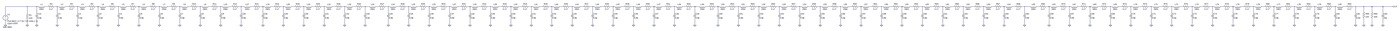
[diagram p0: schematic 64 cell_pc(V)=1000.asc, whole sheet]
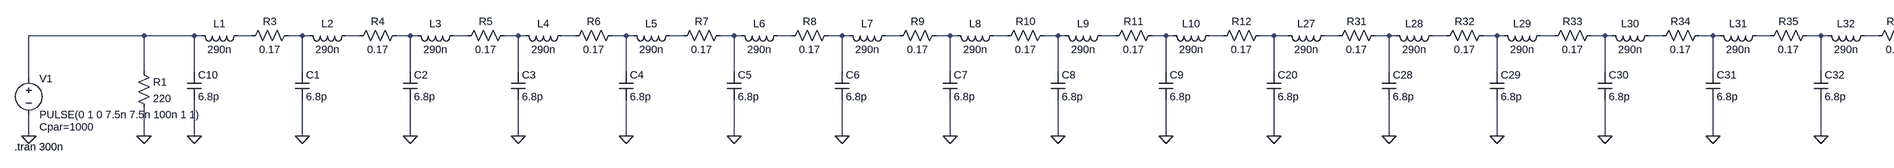
[diagram p1: schematic 64 cell_pc(V)=1000.asc, part, row 1 of 1, column 1 of 4]
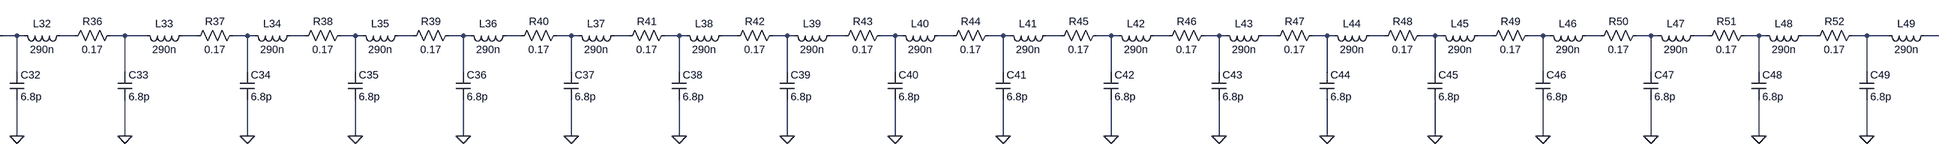
[diagram p2: schematic 64 cell_pc(V)=1000.asc, part, row 1 of 1, column 2 of 4]
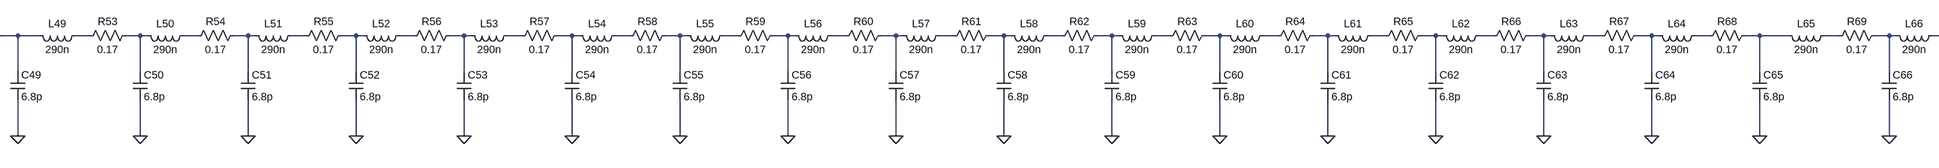
[diagram p3: schematic 64 cell_pc(V)=1000.asc, part, row 1 of 1, column 3 of 4]
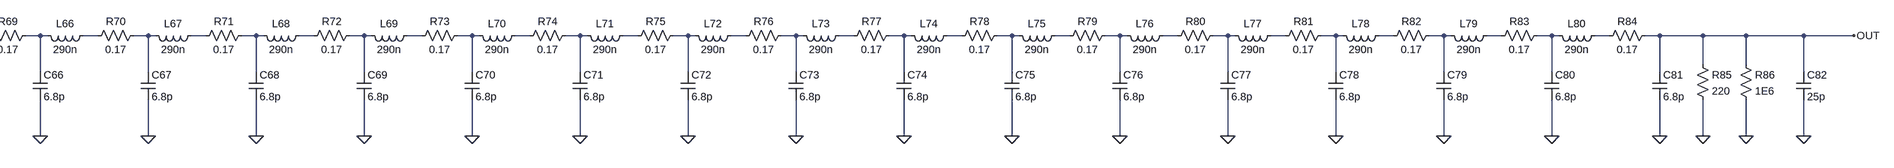
[diagram p4: schematic 64 cell_pc(V)=1000.asc, part, row 1 of 1, column 4 of 4]
64 cell_pc(V)=1000.asc, the LTspice schematic file:
Version 4
SHEET 1 14948 740
WIRE -1152 48 -1408 48
WIRE -1040 48 -1152 48
WIRE -1024 48 -1040 48
WIRE -912 48 -944 48
WIRE -800 48 -832 48
WIRE -784 48 -800 48
WIRE -672 48 -704 48
WIRE -560 48 -592 48
WIRE -544 48 -560 48
WIRE -432 48 -464 48
WIRE -320 48 -352 48
WIRE -304 48 -320 48
WIRE -192 48 -224 48
WIRE -80 48 -112 48
WIRE -64 48 -80 48
WIRE 48 48 16 48
WIRE 160 48 128 48
WIRE 176 48 160 48
WIRE 288 48 256 48
WIRE 400 48 368 48
WIRE 416 48 400 48
WIRE 528 48 496 48
WIRE 640 48 608 48
WIRE 656 48 640 48
WIRE 768 48 736 48
WIRE 880 48 848 48
WIRE 896 48 880 48
WIRE 1008 48 976 48
WIRE 1120 48 1088 48
WIRE 1136 48 1120 48
WIRE 1248 48 1216 48
WIRE 1360 48 1328 48
WIRE 1392 48 1360 48
WIRE 1504 48 1472 48
WIRE 1616 48 1584 48
WIRE 1632 48 1616 48
WIRE 1744 48 1712 48
WIRE 1856 48 1824 48
WIRE 1872 48 1856 48
WIRE 1984 48 1952 48
WIRE 2096 48 2064 48
WIRE 2112 48 2096 48
WIRE 2224 48 2192 48
WIRE 2336 48 2304 48
WIRE 2352 48 2336 48
WIRE 2464 48 2432 48
WIRE 2576 48 2544 48
WIRE 2592 48 2576 48
WIRE 2704 48 2672 48
WIRE 2816 48 2784 48
WIRE 2864 48 2816 48
WIRE 2976 48 2944 48
WIRE 3088 48 3056 48
WIRE 3104 48 3088 48
WIRE 3216 48 3184 48
WIRE 3328 48 3296 48
WIRE 3344 48 3328 48
WIRE 3456 48 3424 48
WIRE 3568 48 3536 48
WIRE 3584 48 3568 48
WIRE 3696 48 3664 48
WIRE 3808 48 3776 48
WIRE 3824 48 3808 48
WIRE 3936 48 3904 48
WIRE 4048 48 4016 48
WIRE 4064 48 4048 48
WIRE 4176 48 4144 48
WIRE 4288 48 4256 48
WIRE 4304 48 4288 48
WIRE 4416 48 4384 48
WIRE 4528 48 4496 48
WIRE 4544 48 4528 48
WIRE 4656 48 4624 48
WIRE 4768 48 4736 48
WIRE 4784 48 4768 48
WIRE 4896 48 4864 48
WIRE 5008 48 4976 48
WIRE 5024 48 5008 48
WIRE 5136 48 5104 48
WIRE 5248 48 5216 48
WIRE 5264 48 5248 48
WIRE 5376 48 5344 48
WIRE 5488 48 5456 48
WIRE 5504 48 5488 48
WIRE 5616 48 5584 48
WIRE 5728 48 5696 48
WIRE 5744 48 5728 48
WIRE 5856 48 5824 48
WIRE 5968 48 5936 48
WIRE 5984 48 5968 48
WIRE 6096 48 6064 48
WIRE 6208 48 6176 48
WIRE 6224 48 6208 48
WIRE 6336 48 6304 48
WIRE 6448 48 6416 48
WIRE 6464 48 6448 48
WIRE 6576 48 6544 48
WIRE 6688 48 6656 48
WIRE 6736 48 6688 48
WIRE 6848 48 6816 48
WIRE 6960 48 6928 48
WIRE 6976 48 6960 48
WIRE 7088 48 7056 48
WIRE 7200 48 7168 48
WIRE 7216 48 7200 48
WIRE 7328 48 7296 48
WIRE 7440 48 7408 48
WIRE 7456 48 7440 48
WIRE 7568 48 7536 48
WIRE 7680 48 7648 48
WIRE 7696 48 7680 48
WIRE 7808 48 7776 48
WIRE 7920 48 7888 48
WIRE 7936 48 7920 48
WIRE 8048 48 8016 48
WIRE 8160 48 8128 48
WIRE 8176 48 8160 48
WIRE 8288 48 8256 48
WIRE 8400 48 8368 48
WIRE 8416 48 8400 48
WIRE 8528 48 8496 48
WIRE 8640 48 8608 48
WIRE 8656 48 8640 48
WIRE 8768 48 8736 48
WIRE 8880 48 8848 48
WIRE 8896 48 8880 48
WIRE 9008 48 8976 48
WIRE 9120 48 9088 48
WIRE 9136 48 9120 48
WIRE 9248 48 9216 48
WIRE 9360 48 9328 48
WIRE 9376 48 9360 48
WIRE 9488 48 9456 48
WIRE 9600 48 9568 48
WIRE 9616 48 9600 48
WIRE 9728 48 9696 48
WIRE 9840 48 9808 48
WIRE 9856 48 9840 48
WIRE 9968 48 9936 48
WIRE 10080 48 10048 48
WIRE 10096 48 10080 48
WIRE 10208 48 10176 48
WIRE 10320 48 10288 48
WIRE 10336 48 10320 48
WIRE 10448 48 10416 48
WIRE 10560 48 10528 48
WIRE 10624 48 10560 48
WIRE 10736 48 10704 48
WIRE 10848 48 10816 48
WIRE 10864 48 10848 48
WIRE 10976 48 10944 48
WIRE 11088 48 11056 48
WIRE 11104 48 11088 48
WIRE 11216 48 11184 48
WIRE 11328 48 11296 48
WIRE 11344 48 11328 48
WIRE 11456 48 11424 48
WIRE 11568 48 11536 48
WIRE 11584 48 11568 48
WIRE 11696 48 11664 48
WIRE 11808 48 11776 48
WIRE 11824 48 11808 48
WIRE 11936 48 11904 48
WIRE 12048 48 12016 48
WIRE 12064 48 12048 48
WIRE 12176 48 12144 48
WIRE 12288 48 12256 48
WIRE 12304 48 12288 48
WIRE 12416 48 12384 48
WIRE 12528 48 12496 48
WIRE 12544 48 12528 48
WIRE 12656 48 12624 48
WIRE 12768 48 12736 48
WIRE 12784 48 12768 48
WIRE 12896 48 12864 48
WIRE 13008 48 12976 48
WIRE 13024 48 13008 48
WIRE 13136 48 13104 48
WIRE 13248 48 13216 48
WIRE 13264 48 13248 48
WIRE 13376 48 13344 48
WIRE 13488 48 13456 48
WIRE 13504 48 13488 48
WIRE 13616 48 13584 48
WIRE 13728 48 13696 48
WIRE 13744 48 13728 48
WIRE 13856 48 13824 48
WIRE 13968 48 13936 48
WIRE 13984 48 13968 48
WIRE 14096 48 14064 48
WIRE 14208 48 14176 48
WIRE 14224 48 14208 48
WIRE 14336 48 14304 48
WIRE 14448 48 14416 48
WIRE 14544 48 14448 48
WIRE 14640 48 14544 48
WIRE 14768 48 14640 48
WIRE 14880 48 14768 48
WIRE 14544 112 14544 48
WIRE 14640 112 14640 48
WIRE -1152 128 -1152 48
WIRE -1040 128 -1040 48
WIRE -800 128 -800 48
WIRE -560 128 -560 48
WIRE -320 128 -320 48
WIRE -80 128 -80 48
WIRE 160 128 160 48
WIRE 400 128 400 48
WIRE 640 128 640 48
WIRE 880 128 880 48
WIRE 1120 128 1120 48
WIRE 1360 128 1360 48
WIRE 1616 128 1616 48
WIRE 1856 128 1856 48
WIRE 2096 128 2096 48
WIRE 2336 128 2336 48
WIRE 2576 128 2576 48
WIRE 2816 128 2816 48
WIRE 3088 128 3088 48
WIRE 3328 128 3328 48
WIRE 3568 128 3568 48
WIRE 3808 128 3808 48
WIRE 4048 128 4048 48
WIRE 4288 128 4288 48
WIRE 4528 128 4528 48
WIRE 4768 128 4768 48
WIRE 5008 128 5008 48
WIRE 5248 128 5248 48
WIRE 5488 128 5488 48
WIRE 5728 128 5728 48
WIRE 5968 128 5968 48
WIRE 6208 128 6208 48
WIRE 6448 128 6448 48
WIRE 6688 128 6688 48
WIRE 6960 128 6960 48
WIRE 7200 128 7200 48
WIRE 7440 128 7440 48
WIRE 7680 128 7680 48
WIRE 7920 128 7920 48
WIRE 8160 128 8160 48
WIRE 8400 128 8400 48
WIRE 8640 128 8640 48
WIRE 8880 128 8880 48
WIRE 9120 128 9120 48
WIRE 9360 128 9360 48
WIRE 9600 128 9600 48
WIRE 9840 128 9840 48
WIRE 10080 128 10080 48
WIRE 10320 128 10320 48
WIRE 10560 128 10560 48
WIRE 10848 128 10848 48
WIRE 11088 128 11088 48
WIRE 11328 128 11328 48
WIRE 11568 128 11568 48
WIRE 11808 128 11808 48
WIRE 12048 128 12048 48
WIRE 12288 128 12288 48
WIRE 12528 128 12528 48
WIRE 12768 128 12768 48
WIRE 13008 128 13008 48
WIRE 13248 128 13248 48
WIRE 13488 128 13488 48
WIRE 13728 128 13728 48
WIRE 13968 128 13968 48
WIRE 14208 128 14208 48
WIRE 14448 128 14448 48
WIRE 14768 128 14768 48
WIRE -1408 144 -1408 48
WIRE -1408 272 -1408 224
WIRE -1152 272 -1152 208
WIRE -1040 272 -1040 192
WIRE -800 272 -800 192
WIRE -560 272 -560 192
WIRE -320 272 -320 192
WIRE -80 272 -80 192
WIRE 160 272 160 192
WIRE 400 272 400 192
WIRE 640 272 640 192
WIRE 880 272 880 192
WIRE 1120 272 1120 192
WIRE 1360 272 1360 192
WIRE 1616 272 1616 192
WIRE 1856 272 1856 192
WIRE 2096 272 2096 192
WIRE 2336 272 2336 192
WIRE 2576 272 2576 192
WIRE 2816 272 2816 192
WIRE 3088 272 3088 192
WIRE 3328 272 3328 192
WIRE 3568 272 3568 192
WIRE 3808 272 3808 192
WIRE 4048 272 4048 192
WIRE 4288 272 4288 192
WIRE 4528 272 4528 192
WIRE 4768 272 4768 192
WIRE 5008 272 5008 192
WIRE 5248 272 5248 192
WIRE 5488 272 5488 192
WIRE 5728 272 5728 192
WIRE 5968 272 5968 192
WIRE 6208 272 6208 192
WIRE 6448 272 6448 192
WIRE 6688 272 6688 192
WIRE 6960 272 6960 192
WIRE 7200 272 7200 192
WIRE 7440 272 7440 192
WIRE 7680 272 7680 192
WIRE 7920 272 7920 192
WIRE 8160 272 8160 192
WIRE 8400 272 8400 192
WIRE 8640 272 8640 192
WIRE 8880 272 8880 192
WIRE 9120 272 9120 192
WIRE 9360 272 9360 192
WIRE 9600 272 9600 192
WIRE 9840 272 9840 192
WIRE 10080 272 10080 192
WIRE 10320 272 10320 192
WIRE 10560 272 10560 192
WIRE 10848 272 10848 192
WIRE 11088 272 11088 192
WIRE 11328 272 11328 192
WIRE 11568 272 11568 192
WIRE 11808 272 11808 192
WIRE 12048 272 12048 192
WIRE 12288 272 12288 192
WIRE 12528 272 12528 192
WIRE 12768 272 12768 192
WIRE 13008 272 13008 192
WIRE 13248 272 13248 192
WIRE 13488 272 13488 192
WIRE 13728 272 13728 192
WIRE 13968 272 13968 192
WIRE 14208 272 14208 192
WIRE 14448 272 14448 192
WIRE 14544 272 14544 192
WIRE 14640 272 14640 192
WIRE 14768 272 14768 192
FLAG -1408 272 0
FLAG -1040 272 0
FLAG -800 272 0
FLAG -560 272 0
FLAG -320 272 0
FLAG -80 272 0
FLAG 160 272 0
FLAG 400 272 0
FLAG 640 272 0
FLAG 880 272 0
FLAG 1120 272 0
FLAG 1360 272 0
FLAG 1616 272 0
FLAG 1856 272 0
FLAG 2096 272 0
FLAG 2336 272 0
FLAG 2576 272 0
FLAG 2816 272 0
FLAG 3088 272 0
FLAG 3328 272 0
FLAG 3568 272 0
FLAG 3808 272 0
FLAG 4048 272 0
FLAG 4288 272 0
FLAG 4528 272 0
FLAG 4768 272 0
FLAG 5008 272 0
FLAG 5248 272 0
FLAG 5488 272 0
FLAG 5728 272 0
FLAG 5968 272 0
FLAG 6208 272 0
FLAG 6448 272 0
FLAG 6688 272 0
FLAG 6960 272 0
FLAG 7200 272 0
FLAG 7440 272 0
FLAG 7680 272 0
FLAG 7920 272 0
FLAG 8160 272 0
FLAG 8400 272 0
FLAG 8640 272 0
FLAG 8880 272 0
FLAG 9120 272 0
FLAG 9360 272 0
FLAG 9600 272 0
FLAG 9840 272 0
FLAG 10080 272 0
FLAG 10320 272 0
FLAG 10560 272 0
FLAG 10848 272 0
FLAG 11088 272 0
FLAG 11328 272 0
FLAG 11568 272 0
FLAG 11808 272 0
FLAG 12048 272 0
FLAG 12288 272 0
FLAG 12528 272 0
FLAG 12768 272 0
FLAG 13008 272 0
FLAG 13248 272 0
FLAG 13488 272 0
FLAG 13728 272 0
FLAG 13968 272 0
FLAG 14208 272 0
FLAG 14448 272 0
FLAG 14544 272 0
FLAG 14640 272 0
FLAG 14768 272 0
FLAG 14880 48 OUT
FLAG -1152 272 0
SYMBOL voltage -1408 128 R0
WINDOW 123 0 0 Left 0
WINDOW 39 24 124 Left 2
SYMATTR SpiceLine Cpar=1000
SYMATTR InstName V1
SYMATTR Value PULSE(0 1 0 7.5n 7.5n 100n 1 1)
SYMBOL ind -928 32 R90
WINDOW 0 5 56 VBottom 2
WINDOW 3 32 56 VTop 2
SYMATTR InstName L1
SYMATTR Value 290n
SYMBOL res -816 32 R90
WINDOW 0 0 56 VBottom 2
WINDOW 3 32 56 VTop 2
SYMATTR InstName R3
SYMATTR Value 0.17
SYMBOL cap -816 128 R0
SYMATTR InstName C1
SYMATTR Value 6.8p
SYMBOL ind -688 32 R90
WINDOW 0 5 56 VBottom 2
WINDOW 3 32 56 VTop 2
SYMATTR InstName L2
SYMATTR Value 290n
SYMBOL res -576 32 R90
WINDOW 0 0 56 VBottom 2
WINDOW 3 32 56 VTop 2
SYMATTR InstName R4
SYMATTR Value 0.17
SYMBOL cap -576 128 R0
SYMATTR InstName C2
SYMATTR Value 6.8p
SYMBOL ind -448 32 R90
WINDOW 0 5 56 VBottom 2
WINDOW 3 32 56 VTop 2
SYMATTR InstName L3
SYMATTR Value 290n
SYMBOL res -336 32 R90
WINDOW 0 0 56 VBottom 2
WINDOW 3 32 56 VTop 2
SYMATTR InstName R5
SYMATTR Value 0.17
SYMBOL cap -336 128 R0
SYMATTR InstName C3
SYMATTR Value 6.8p
SYMBOL ind -208 32 R90
WINDOW 0 5 56 VBottom 2
WINDOW 3 32 56 VTop 2
SYMATTR InstName L4
SYMATTR Value 290n
SYMBOL res -96 32 R90
WINDOW 0 0 56 VBottom 2
WINDOW 3 32 56 VTop 2
SYMATTR InstName R6
SYMATTR Value 0.17
SYMBOL cap -96 128 R0
SYMATTR InstName C4
SYMATTR Value 6.8p
SYMBOL ind 32 32 R90
WINDOW 0 5 56 VBottom 2
WINDOW 3 32 56 VTop 2
SYMATTR InstName L5
SYMATTR Value 290n
SYMBOL res 144 32 R90
WINDOW 0 0 56 VBottom 2
WINDOW 3 32 56 VTop 2
SYMATTR InstName R7
SYMATTR Value 0.17
SYMBOL cap 144 128 R0
SYMATTR InstName C5
SYMATTR Value 6.8p
SYMBOL ind 272 32 R90
WINDOW 0 5 56 VBottom 2
WINDOW 3 32 56 VTop 2
SYMATTR InstName L6
SYMATTR Value 290n
SYMBOL res 384 32 R90
WINDOW 0 0 56 VBottom 2
WINDOW 3 32 56 VTop 2
SYMATTR InstName R8
SYMATTR Value 0.17
SYMBOL cap 384 128 R0
SYMATTR InstName C6
SYMATTR Value 6.8p
SYMBOL ind 512 32 R90
WINDOW 0 5 56 VBottom 2
WINDOW 3 32 56 VTop 2
SYMATTR InstName L7
SYMATTR Value 290n
SYMBOL res 624 32 R90
WINDOW 0 0 56 VBottom 2
WINDOW 3 32 56 VTop 2
SYMATTR InstName R9
SYMATTR Value 0.17
SYMBOL cap 624 128 R0
SYMATTR InstName C7
SYMATTR Value 6.8p
SYMBOL ind 752 32 R90
WINDOW 0 5 56 VBottom 2
WINDOW 3 32 56 VTop 2
SYMATTR InstName L8
SYMATTR Value 290n
SYMBOL res 864 32 R90
WINDOW 0 0 56 VBottom 2
WINDOW 3 32 56 VTop 2
SYMATTR InstName R10
SYMATTR Value 0.17
SYMBOL cap 864 128 R0
SYMATTR InstName C8
SYMATTR Value 6.8p
SYMBOL ind 992 32 R90
WINDOW 0 5 56 VBottom 2
WINDOW 3 32 56 VTop 2
SYMATTR InstName L9
SYMATTR Value 290n
SYMBOL res 1104 32 R90
WINDOW 0 0 56 VBottom 2
WINDOW 3 32 56 VTop 2
SYMATTR InstName R11
SYMATTR Value 0.17
SYMBOL cap 1104 128 R0
SYMATTR InstName C9
SYMATTR Value 6.8p
SYMBOL ind 1232 32 R90
WINDOW 0 5 56 VBottom 2
WINDOW 3 32 56 VTop 2
SYMATTR InstName L10
SYMATTR Value 290n
SYMBOL res 1344 32 R90
WINDOW 0 0 56 VBottom 2
WINDOW 3 32 56 VTop 2
SYMATTR InstName R12
SYMATTR Value 0.17
SYMBOL cap 1344 128 R0
SYMATTR InstName C20
SYMATTR Value 6.8p
SYMBOL ind 1488 32 R90
WINDOW 0 5 56 VBottom 2
WINDOW 3 32 56 VTop 2
SYMATTR InstName L27
SYMATTR Value 290n
SYMBOL res 1600 32 R90
WINDOW 0 0 56 VBottom 2
WINDOW 3 32 56 VTop 2
SYMATTR InstName R31
SYMATTR Value 0.17
SYMBOL cap 1600 128 R0
SYMATTR InstName C28
SYMATTR Value 6.8p
SYMBOL ind 1728 32 R90
WINDOW 0 5 56 VBottom 2
WINDOW 3 32 56 VTop 2
SYMATTR InstName L28
SYMATTR Value 290n
SYMBOL res 1840 32 R90
WINDOW 0 0 56 VBottom 2
WINDOW 3 32 56 VTop 2
SYMATTR InstName R32
SYMATTR Value 0.17
SYMBOL cap 1840 128 R0
SYMATTR InstName C29
SYMATTR Value 6.8p
SYMBOL ind 1968 32 R90
WINDOW 0 5 56 VBottom 2
WINDOW 3 32 56 VTop 2
SYMATTR InstName L29
SYMATTR Value 290n
SYMBOL res 2080 32 R90
WINDOW 0 0 56 VBottom 2
WINDOW 3 32 56 VTop 2
SYMATTR InstName R33
SYMATTR Value 0.17
SYMBOL cap 2080 128 R0
SYMATTR InstName C30
SYMATTR Value 6.8p
SYMBOL ind 2208 32 R90
WINDOW 0 5 56 VBottom 2
WINDOW 3 32 56 VTop 2
SYMATTR InstName L30
SYMATTR Value 290n
SYMBOL res 2320 32 R90
WINDOW 0 0 56 VBottom 2
WINDOW 3 32 56 VTop 2
SYMATTR InstName R34
SYMATTR Value 0.17
SYMBOL cap 2320 128 R0
SYMATTR InstName C31
SYMATTR Value 6.8p
SYMBOL ind 2448 32 R90
WINDOW 0 5 56 VBottom 2
WINDOW 3 32 56 VTop 2
SYMATTR InstName L31
SYMATTR Value 290n
SYMBOL res 2560 32 R90
WINDOW 0 0 56 VBottom 2
WINDOW 3 32 56 VTop 2
SYMATTR InstName R35
SYMATTR Value 0.17
SYMBOL cap 2560 128 R0
SYMATTR InstName C32
SYMATTR Value 6.8p
SYMBOL ind 2688 32 R90
WINDOW 0 5 56 VBottom 2
WINDOW 3 32 56 VTop 2
SYMATTR InstName L32
SYMATTR Value 290n
SYMBOL res 2800 32 R90
WINDOW 0 0 56 VBottom 2
WINDOW 3 32 56 VTop 2
SYMATTR InstName R36
SYMATTR Value 0.17
SYMBOL cap 2800 128 R0
SYMATTR InstName C33
SYMATTR Value 6.8p
SYMBOL ind 2960 32 R90
WINDOW 0 5 56 VBottom 2
WINDOW 3 32 56 VTop 2
SYMATTR InstName L33
SYMATTR Value 290n
SYMBOL res 3072 32 R90
WINDOW 0 0 56 VBottom 2
WINDOW 3 32 56 VTop 2
SYMATTR InstName R37
SYMATTR Value 0.17
SYMBOL cap 3072 128 R0
SYMATTR InstName C34
SYMATTR Value 6.8p
SYMBOL ind 3200 32 R90
WINDOW 0 5 56 VBottom 2
WINDOW 3 32 56 VTop 2
SYMATTR InstName L34
SYMATTR Value 290n
SYMBOL res 3312 32 R90
WINDOW 0 0 56 VBottom 2
WINDOW 3 32 56 VTop 2
SYMATTR InstName R38
SYMATTR Value 0.17
SYMBOL cap 3312 128 R0
SYMATTR InstName C35
SYMATTR Value 6.8p
SYMBOL ind 3440 32 R90
WINDOW 0 5 56 VBottom 2
WINDOW 3 32 56 VTop 2
SYMATTR InstName L35
SYMATTR Value 290n
SYMBOL res 3552 32 R90
WINDOW 0 0 56 VBottom 2
WINDOW 3 32 56 VTop 2
SYMATTR InstName R39
SYMATTR Value 0.17
SYMBOL cap 3552 128 R0
SYMATTR InstName C36
SYMATTR Value 6.8p
SYMBOL ind 3680 32 R90
WINDOW 0 5 56 VBottom 2
WINDOW 3 32 56 VTop 2
SYMATTR InstName L36
SYMATTR Value 290n
SYMBOL res 3792 32 R90
WINDOW 0 0 56 VBottom 2
WINDOW 3 32 56 VTop 2
SYMATTR InstName R40
SYMATTR Value 0.17
SYMBOL cap 3792 128 R0
SYMATTR InstName C37
SYMATTR Value 6.8p
SYMBOL ind 3920 32 R90
WINDOW 0 5 56 VBottom 2
WINDOW 3 32 56 VTop 2
SYMATTR InstName L37
SYMATTR Value 290n
SYMBOL res 4032 32 R90
WINDOW 0 0 56 VBottom 2
WINDOW 3 32 56 VTop 2
SYMATTR InstName R41
SYMATTR Value 0.17
SYMBOL cap 4032 128 R0
SYMATTR InstName C38
SYMATTR Value 6.8p
SYMBOL ind 4160 32 R90
WINDOW 0 5 56 VBottom 2
WINDOW 3 32 56 VTop 2
SYMATTR InstName L38
SYMATTR Value 290n
SYMBOL res 4272 32 R90
WINDOW 0 0 56 VBottom 2
WINDOW 3 32 56 VTop 2
SYMATTR InstName R42
SYMATTR Value 0.17
SYMBOL cap 4272 128 R0
SYMATTR InstName C39
SYMATTR Value 6.8p
SYMBOL ind 4400 32 R90
WINDOW 0 5 56 VBottom 2
WINDOW 3 32 56 VTop 2
SYMATTR InstName L39
SYMATTR Value 290n
SYMBOL res 4512 32 R90
WINDOW 0 0 56 VBottom 2
WINDOW 3 32 56 VTop 2
SYMATTR InstName R43
SYMATTR Value 0.17
SYMBOL cap 4512 128 R0
SYMATTR InstName C40
SYMATTR Value 6.8p
SYMBOL ind 4640 32 R90
WINDOW 0 5 56 VBottom 2
WINDOW 3 32 56 VTop 2
SYMATTR InstName L40
SYMATTR Value 290n
SYMBOL res 4752 32 R90
WINDOW 0 0 56 VBottom 2
WINDOW 3 32 56 VTop 2
SYMATTR InstName R44
SYMATTR Value 0.17
SYMBOL cap 4752 128 R0
SYMATTR InstName C41
SYMATTR Value 6.8p
SYMBOL ind 4880 32 R90
WINDOW 0 5 56 VBottom 2
WINDOW 3 32 56 VTop 2
SYMATTR InstName L41
SYMATTR Value 290n
SYMBOL res 4992 32 R90
WINDOW 0 0 56 VBottom 2
WINDOW 3 32 56 VTop 2
SYMATTR InstName R45
SYMATTR Value 0.17
SYMBOL cap 4992 128 R0
SYMATTR InstName C42
SYMATTR Value 6.8p
SYMBOL ind 5120 32 R90
WINDOW 0 5 56 VBottom 2
WINDOW 3 32 56 VTop 2
SYMATTR InstName L42
SYMATTR Value 290n
SYMBOL res 5232 32 R90
WINDOW 0 0 56 VBottom 2
WINDOW 3 32 56 VTop 2
SYMATTR InstName R46
SYMATTR Value 0.17
SYMBOL cap 5232 128 R0
SYMATTR InstName C43
SYMATTR Value 6.8p
SYMBOL ind 5360 32 R90
WINDOW 0 5 56 VBottom 2
WINDOW 3 32 56 VTop 2
SYMATTR InstName L43
SYMATTR Value 290n
SYMBOL res 5472 32 R90
WINDOW 0 0 56 VBottom 2
WINDOW 3 32 56 VTop 2
SYMATTR InstName R47
SYMATTR Value 0.17
SYMBOL cap 5472 128 R0
SYMATTR InstName C44
SYMATTR Value 6.8p
SYMBOL ind 5600 32 R90
WINDOW 0 5 56 VBottom 2
WINDOW 3 32 56 VTop 2
SYMATTR InstName L44
SYMATTR Value 290n
SYMBOL res 5712 32 R90
WINDOW 0 0 56 VBottom 2
WINDOW 3 32 56 VTop 2
SYMATTR InstName R48
SYMATTR Value 0.17
SYMBOL cap 5712 128 R0
SYMATTR InstName C45
SYMATTR Value 6.8p
SYMBOL ind 5840 32 R90
WINDOW 0 5 56 VBottom 2
WINDOW 3 32 56 VTop 2
SYMATTR InstName L45
SYMATTR Value 290n
SYMBOL res 5952 32 R90
WINDOW 0 0 56 VBottom 2
WINDOW 3 32 56 VTop 2
SYMATTR InstName R49
SYMATTR Value 0.17
SYMBOL cap 5952 128 R0
SYMATTR InstName C46
SYMATTR Value 6.8p
SYMBOL ind 6080 32 R90
WINDOW 0 5 56 VBottom 2
WINDOW 3 32 56 VTop 2
SYMATTR InstName L46
SYMATTR Value 290n
SYMBOL res 6192 32 R90
WINDOW 0 0 56 VBottom 2
WINDOW 3 32 56 VTop 2
SYMATTR InstName R50
SYMATTR Value 0.17
SYMBOL cap 6192 128 R0
SYMATTR InstName C47
SYMATTR Value 6.8p
SYMBOL ind 6320 32 R90
WINDOW 0 5 56 VBottom 2
WINDOW 3 32 56 VTop 2
SYMATTR InstName L47
SYMATTR Value 290n
SYMBOL res 6432 32 R90
WINDOW 0 0 56 VBottom 2
WINDOW 3 32 56 VTop 2
SYMATTR InstName R51
SYMATTR Value 0.17
SYMBOL cap 6432 128 R0
SYMATTR InstName C48
SYMATTR Value 6.8p
SYMBOL ind 6560 32 R90
WINDOW 0 5 56 VBottom 2
WINDOW 3 32 56 VTop 2
SYMATTR InstName L48
SYMATTR Value 290n
SYMBOL res 6672 32 R90
WINDOW 0 0 56 VBottom 2
WINDOW 3 32 56 VTop 2
SYMATTR InstName R52
SYMATTR Value 0.17
SYMBOL cap 6672 128 R0
SYMATTR InstName C49
SYMATTR Value 6.8p
SYMBOL ind 6832 32 R90
WINDOW 0 5 56 VBottom 2
WINDOW 3 32 56 VTop 2
SYMATTR InstName L49
SYMATTR Value 290n
SYMBOL res 6944 32 R90
WINDOW 0 0 56 VBottom 2
WINDOW 3 32 56 VTop 2
SYMATTR InstName R53
SYMATTR Value 0.17
SYMBOL cap 6944 128 R0
SYMATTR InstName C50
SYMATTR Value 6.8p
SYMBOL ind 7072 32 R90
WINDOW 0 5 56 VBottom 2
WINDOW 3 32 56 VTop 2
SYMATTR InstName L50
SYMATTR Value 290n
SYMBOL res 7184 32 R90
WINDOW 0 0 56 VBottom 2
WINDOW 3 32 56 VTop 2
SYMATTR InstName R54
SYMATTR Value 0.17
SYMBOL cap 7184 128 R0
SYMATTR InstName C51
SYMATTR Value 6.8p
SYMBOL ind 7312 32 R90
WINDOW 0 5 56 VBottom 2
WINDOW 3 32 56 VTop 2
SYMATTR InstName L51
SYMATTR Value 290n
SYMBOL res 7424 32 R90
WINDOW 0 0 56 VBottom 2
WINDOW 3 32 56 VTop 2
SYMATTR InstName R55
SYMATTR Value 0.17
SYMBOL cap 7424 128 R0
SYMATTR InstName C52
SYMATTR Value 6.8p
SYMBOL ind 7552 32 R90
WINDOW 0 5 56 VBottom 2
WINDOW 3 32 56 VTop 2
SYMATTR InstName L52
SYMATTR Value 290n
SYMBOL res 7664 32 R90
WINDOW 0 0 56 VBottom 2
WINDOW 3 32 56 VTop 2
SYMATTR InstName R56
SYMATTR Value 0.17
SYMBOL cap 7664 128 R0
SYMATTR InstName C53
SYMATTR Value 6.8p
SYMBOL ind 7792 32 R90
WINDOW 0 5 56 VBottom 2
WINDOW 3 32 56 VTop 2
SYMATTR InstName L53
SYMATTR Value 290n
SYMBOL res 7904 32 R90
WINDOW 0 0 56 VBottom 2
WINDOW 3 32 56 VTop 2
SYMATTR InstName R57
SYMATTR Value 0.17
SYMBOL cap 7904 128 R0
SYMATTR InstName C54
SYMATTR Value 6.8p
SYMBOL ind 8032 32 R90
WINDOW 0 5 56 VBottom 2
WINDOW 3 32 56 VTop 2
SYMATTR InstName L54
SYMATTR Value 290n
SYMBOL res 8144 32 R90
WINDOW 0 0 56 VBottom 2
WINDOW 3 32 56 VTop 2
SYMATTR InstName R58
SYMATTR Value 0.17
SYMBOL cap 8144 128 R0
SYMATTR InstName C55
SYMATTR Value 6.8p
SYMBOL ind 8272 32 R90
WINDOW 0 5 56 VBottom 2
WINDOW 3 32 56 VTop 2
SYMATTR InstName L55
SYMATTR Value 290n
SYMBOL res 8384 32 R90
WINDOW 0 0 56 VBottom 2
WINDOW 3 32 56 VTop 2
SYMATTR InstName R59
SYMATTR Value 0.17
SYMBOL cap 8384 128 R0
SYMATTR InstName C56
SYMATTR Value 6.8p
SYMBOL ind 8512 32 R90
WINDOW 0 5 56 VBottom 2
WINDOW 3 32 56 VTop 2
SYMATTR InstName L56
SYMATTR Value 290n
SYMBOL res 8624 32 R90
WINDOW 0 0 56 VBottom 2
WINDOW 3 32 56 VTop 2
SYMATTR InstName R60
SYMATTR Value 0.17
SYMBOL cap 8624 128 R0
SYMATTR InstName C57
SYMATTR Value 6.8p
SYMBOL ind 8752 32 R90
WINDOW 0 5 56 VBottom 2
WINDOW 3 32 56 VTop 2
SYMATTR InstName L57
SYMATTR Value 290n
SYMBOL res 8864 32 R90
WINDOW 0 0 56 VBottom 2
WINDOW 3 32 56 VTop 2
SYMATTR InstName R61
SYMATTR Value 0.17
SYMBOL cap 8864 128 R0
SYMATTR InstName C58
SYMATTR Value 6.8p
SYMBOL ind 8992 32 R90
WINDOW 0 5 56 VBottom 2
WINDOW 3 32 56 VTop 2
SYMATTR InstName L58
SYMATTR Value 290n
SYMBOL res 9104 32 R90
WINDOW 0 0 56 VBottom 2
WINDOW 3 32 56 VTop 2
SYMATTR InstName R62
SYMATTR Value 0.17
SYMBOL cap 9104 128 R0
SYMATTR InstName C59
SYMATTR Value 6.8p
SYMBOL ind 9232 32 R90
WINDOW 0 5 56 VBottom 2
WINDOW 3 32 56 VTop 2
SYMATTR InstName L59
SYMATTR Value 290n
SYMBOL res 9344 32 R90
WINDOW 0 0 56 VBottom 2
WINDOW 3 32 56 VTop 2
SYMATTR InstName R63
SYMATTR Value 0.17
SYMBOL cap 9344 128 R0
SYMATTR InstName C60
SYMATTR Value 6.8p
SYMBOL ind 9472 32 R90
WINDOW 0 5 56 VBottom 2
WINDOW 3 32 56 VTop 2
SYMATTR InstName L60
SYMATTR Value 290n
SYMBOL res 9584 32 R90
WINDOW 0 0 56 VBottom 2
WINDOW 3 32 56 VTop 2
SYMATTR InstName R64
SYMATTR Value 0.17
SYMBOL cap 9584 128 R0
SYMATTR InstName C61
SYMATTR Value 6.8p
SYMBOL ind 9712 32 R90
WINDOW 0 5 56 VBottom 2
WINDOW 3 32 56 VTop 2
SYMATTR InstName L61
SYMATTR Value 290n
SYMBOL res 9824 32 R90
WINDOW 0 0 56 VBottom 2
WINDOW 3 32 56 VTop 2
SYMATTR InstName R65
SYMATTR Value 0.17
SYMBOL cap 9824 128 R0
SYMATTR InstName C62
SYMATTR Value 6.8p
SYMBOL ind 9952 32 R90
WINDOW 0 5 56 VBottom 2
WINDOW 3 32 56 VTop 2
SYMATTR InstName L62
SYMATTR Value 290n
SYMBOL res 10064 32 R90
WINDOW 0 0 56 VBottom 2
WINDOW 3 32 56 VTop 2
SYMATTR InstName R66
SYMATTR Value 0.17
SYMBOL cap 10064 128 R0
SYMATTR InstName C63
SYMATTR Value 6.8p
SYMBOL ind 10192 32 R90
WINDOW 0 5 56 VBottom 2
WINDOW 3 32 56 VTop 2
SYMATTR InstName L63
SYMATTR Value 290n
SYMBOL res 10304 32 R90
WINDOW 0 0 56 VBottom 2
WINDOW 3 32 56 VTop 2
SYMATTR InstName R67
SYMATTR Value 0.17
SYMBOL cap 10304 128 R0
SYMATTR InstName C64
SYMATTR Value 6.8p
SYMBOL ind 10432 32 R90
WINDOW 0 5 56 VBottom 2
WINDOW 3 32 56 VTop 2
SYMATTR InstName L64
SYMATTR Value 290n
SYMBOL res 10544 32 R90
WINDOW 0 0 56 VBottom 2
WINDOW 3 32 56 VTop 2
SYMATTR InstName R68
SYMATTR Value 0.17
SYMBOL cap 10544 128 R0
SYMATTR InstName C65
SYMATTR Value 6.8p
SYMBOL ind 10720 32 R90
WINDOW 0 5 56 VBottom 2
WINDOW 3 32 56 VTop 2
SYMATTR InstName L65
SYMATTR Value 290n
SYMBOL res 10832 32 R90
WINDOW 0 0 56 VBottom 2
WINDOW 3 32 56 VTop 2
SYMATTR InstName R69
SYMATTR Value 0.17
SYMBOL cap 10832 128 R0
SYMATTR InstName C66
SYMATTR Value 6.8p
SYMBOL ind 10960 32 R90
WINDOW 0 5 56 VBottom 2
WINDOW 3 32 56 VTop 2
SYMATTR InstName L66
SYMATTR Value 290n
SYMBOL res 11072 32 R90
WINDOW 0 0 56 VBottom 2
WINDOW 3 32 56 VTop 2
SYMATTR InstName R70
SYMATTR Value 0.17
SYMBOL cap 11072 128 R0
SYMATTR InstName C67
SYMATTR Value 6.8p
SYMBOL ind 11200 32 R90
WINDOW 0 5 56 VBottom 2
WINDOW 3 32 56 VTop 2
SYMATTR InstName L67
SYMATTR Value 290n
SYMBOL res 11312 32 R90
WINDOW 0 0 56 VBottom 2
WINDOW 3 32 56 VTop 2
SYMATTR InstName R71
SYMATTR Value 0.17
SYMBOL cap 11312 128 R0
SYMATTR InstName C68
SYMATTR Value 6.8p
SYMBOL ind 11440 32 R90
WINDOW 0 5 56 VBottom 2
WINDOW 3 32 56 VTop 2
SYMATTR InstName L68
SYMATTR Value 290n
SYMBOL res 11552 32 R90
WINDOW 0 0 56 VBottom 2
WINDOW 3 32 56 VTop 2
SYMATTR InstName R72
SYMATTR Value 0.17
SYMBOL cap 11552 128 R0
SYMATTR InstName C69
SYMATTR Value 6.8p
SYMBOL ind 11680 32 R90
WINDOW 0 5 56 VBottom 2
WINDOW 3 32 56 VTop 2
SYMATTR InstName L69
SYMATTR Value 290n
SYMBOL res 11792 32 R90
WINDOW 0 0 56 VBottom 2
WINDOW 3 32 56 VTop 2
SYMATTR InstName R73
SYMATTR Value 0.17
SYMBOL cap 11792 128 R0
SYMATTR InstName C70
SYMATTR Value 6.8p
SYMBOL ind 11920 32 R90
WINDOW 0 5 56 VBottom 2
WINDOW 3 32 56 VTop 2
SYMATTR InstName L70
SYMATTR Value 290n
SYMBOL res 12032 32 R90
WINDOW 0 0 56 VBottom 2
WINDOW 3 32 56 VTop 2
SYMATTR InstName R74
SYMATTR Value 0.17
SYMBOL cap 12032 128 R0
SYMATTR InstName C71
SYMATTR Value 6.8p
SYMBOL ind 12160 32 R90
WINDOW 0 5 56 VBottom 2
WINDOW 3 32 56 VTop 2
SYMATTR InstName L71
SYMATTR Value 290n
SYMBOL res 12272 32 R90
WINDOW 0 0 56 VBottom 2
WINDOW 3 32 56 VTop 2
SYMATTR InstName R75
SYMATTR Value 0.17
SYMBOL cap 12272 128 R0
SYMATTR InstName C72
SYMATTR Value 6.8p
SYMBOL ind 12400 32 R90
WINDOW 0 5 56 VBottom 2
WINDOW 3 32 56 VTop 2
SYMATTR InstName L72
SYMATTR Value 290n
SYMBOL res 12512 32 R90
WINDOW 0 0 56 VBottom 2
WINDOW 3 32 56 VTop 2
SYMATTR InstName R76
SYMATTR Value 0.17
SYMBOL cap 12512 128 R0
SYMATTR InstName C73
SYMATTR Value 6.8p
SYMBOL ind 12640 32 R90
WINDOW 0 5 56 VBottom 2
WINDOW 3 32 56 VTop 2
SYMATTR InstName L73
SYMATTR Value 290n
SYMBOL res 12752 32 R90
WINDOW 0 0 56 VBottom 2
WINDOW 3 32 56 VTop 2
SYMATTR InstName R77
SYMATTR Value 0.17
SYMBOL cap 12752 128 R0
SYMATTR InstName C74
SYMATTR Value 6.8p
SYMBOL ind 12880 32 R90
WINDOW 0 5 56 VBottom 2
WINDOW 3 32 56 VTop 2
SYMATTR InstName L74
SYMATTR Value 290n
SYMBOL res 12992 32 R90
WINDOW 0 0 56 VBottom 2
WINDOW 3 32 56 VTop 2
SYMATTR InstName R78
SYMATTR Value 0.17
SYMBOL cap 12992 128 R0
SYMATTR InstName C75
SYMATTR Value 6.8p
SYMBOL ind 13120 32 R90
WINDOW 0 5 56 VBottom 2
WINDOW 3 32 56 VTop 2
SYMATTR InstName L75
SYMATTR Value 290n
SYMBOL res 13232 32 R90
WINDOW 0 0 56 VBottom 2
WINDOW 3 32 56 VTop 2
SYMATTR InstName R79
SYMATTR Value 0.17
SYMBOL cap 13232 128 R0
SYMATTR InstName C76
SYMATTR Value 6.8p
SYMBOL ind 13360 32 R90
WINDOW 0 5 56 VBottom 2
WINDOW 3 32 56 VTop 2
SYMATTR InstName L76
SYMATTR Value 290n
SYMBOL res 13472 32 R90
WINDOW 0 0 56 VBottom 2
WINDOW 3 32 56 VTop 2
SYMATTR InstName R80
SYMATTR Value 0.17
SYMBOL cap 13472 128 R0
SYMATTR InstName C77
SYMATTR Value 6.8p
SYMBOL ind 13600 32 R90
WINDOW 0 5 56 VBottom 2
WINDOW 3 32 56 VTop 2
SYMATTR InstName L77
SYMATTR Value 290n
SYMBOL res 13712 32 R90
WINDOW 0 0 56 VBottom 2
WINDOW 3 32 56 VTop 2
SYMATTR InstName R81
SYMATTR Value 0.17
SYMBOL cap 13712 128 R0
SYMATTR InstName C78
SYMATTR Value 6.8p
SYMBOL ind 13840 32 R90
WINDOW 0 5 56 VBottom 2
WINDOW 3 32 56 VTop 2
SYMATTR InstName L78
SYMATTR Value 290n
SYMBOL res 13952 32 R90
WINDOW 0 0 56 VBottom 2
WINDOW 3 32 56 VTop 2
SYMATTR InstName R82
SYMATTR Value 0.17
SYMBOL cap 13952 128 R0
SYMATTR InstName C79
SYMATTR Value 6.8p
SYMBOL ind 14080 32 R90
WINDOW 0 5 56 VBottom 2
WINDOW 3 32 56 VTop 2
SYMATTR InstName L79
SYMATTR Value 290n
SYMBOL res 14192 32 R90
WINDOW 0 0 56 VBottom 2
WINDOW 3 32 56 VTop 2
SYMATTR InstName R83
SYMATTR Value 0.17
SYMBOL cap 14192 128 R0
SYMATTR InstName C80
SYMATTR Value 6.8p
SYMBOL ind 14320 32 R90
WINDOW 0 5 56 VBottom 2
WINDOW 3 32 56 VTop 2
SYMATTR InstName L80
SYMATTR Value 290n
SYMBOL res 14432 32 R90
WINDOW 0 0 56 VBottom 2
WINDOW 3 32 56 VTop 2
SYMATTR InstName R84
SYMATTR Value 0.17
SYMBOL cap 14432 128 R0
SYMATTR InstName C81
SYMATTR Value 6.8p
SYMBOL res 14528 96 R0
SYMATTR InstName R85
SYMATTR Value 220
SYMBOL res 14624 96 R0
SYMATTR InstName R86
SYMATTR Value 1E6
SYMBOL cap 14752 128 R0
SYMATTR InstName C82
SYMATTR Value 25p
SYMBOL res -1168 112 R0
SYMATTR InstName R1
SYMATTR Value 220
SYMBOL cap -1056 128 R0
SYMATTR InstName C10
SYMATTR Value 6.8p
TEXT -1440 296 Left 2 !.tran 300n

The netlist it stands for:
* 64 cell_pc(V)=1000.asc
V1 N001 0 PULSE(0 1 0 7.5n 7.5n 100n 1 1) Cpar=1000
L1 N002 N001 290n
R3 N003 N002 0.17
C1 N003 0 6.8p
L2 N004 N003 290n
R4 N005 N004 0.17
C2 N005 0 6.8p
L3 N006 N005 290n
R5 N007 N006 0.17
C3 N007 0 6.8p
L4 N008 N007 290n
R6 N009 N008 0.17
C4 N009 0 6.8p
L5 N010 N009 290n
R7 N011 N010 0.17
C5 N011 0 6.8p
L6 N012 N011 290n
R8 N013 N012 0.17
C6 N013 0 6.8p
L7 N014 N013 290n
R9 N015 N014 0.17
C7 N015 0 6.8p
L8 N016 N015 290n
R10 N017 N016 0.17
C8 N017 0 6.8p
L9 N018 N017 290n
R11 N019 N018 0.17
C9 N019 0 6.8p
L10 N020 N019 290n
R12 N021 N020 0.17
C20 N021 0 6.8p
L27 N022 N021 290n
R31 N023 N022 0.17
C28 N023 0 6.8p
L28 N024 N023 290n
R32 N025 N024 0.17
C29 N025 0 6.8p
L29 N026 N025 290n
R33 N027 N026 0.17
C30 N027 0 6.8p
L30 N028 N027 290n
R34 N029 N028 0.17
C31 N029 0 6.8p
L31 N030 N029 290n
R35 N031 N030 0.17
C32 N031 0 6.8p
L32 N032 N031 290n
R36 N033 N032 0.17
C33 N033 0 6.8p
L33 N034 N033 290n
R37 N035 N034 0.17
C34 N035 0 6.8p
L34 N036 N035 290n
R38 N037 N036 0.17
C35 N037 0 6.8p
L35 N038 N037 290n
R39 N039 N038 0.17
C36 N039 0 6.8p
L36 N040 N039 290n
R40 N041 N040 0.17
C37 N041 0 6.8p
L37 N042 N041 290n
R41 N043 N042 0.17
C38 N043 0 6.8p
L38 N044 N043 290n
R42 N045 N044 0.17
C39 N045 0 6.8p
L39 N046 N045 290n
R43 N047 N046 0.17
C40 N047 0 6.8p
L40 N048 N047 290n
R44 N049 N048 0.17
C41 N049 0 6.8p
L41 N050 N049 290n
R45 N051 N050 0.17
C42 N051 0 6.8p
L42 N052 N051 290n
R46 N053 N052 0.17
C43 N053 0 6.8p
L43 N054 N053 290n
R47 N055 N054 0.17
C44 N055 0 6.8p
L44 N056 N055 290n
R48 N057 N056 0.17
C45 N057 0 6.8p
L45 N058 N057 290n
R49 N059 N058 0.17
C46 N059 0 6.8p
L46 N060 N059 290n
R50 N061 N060 0.17
C47 N061 0 6.8p
L47 N062 N061 290n
R51 N063 N062 0.17
C48 N063 0 6.8p
L48 N064 N063 290n
R52 N065 N064 0.17
C49 N065 0 6.8p
L49 N066 N065 290n
R53 N067 N066 0.17
C50 N067 0 6.8p
L50 N068 N067 290n
R54 N069 N068 0.17
C51 N069 0 6.8p
L51 N070 N069 290n
R55 N071 N070 0.17
C52 N071 0 6.8p
L52 N072 N071 290n
R56 N073 N072 0.17
C53 N073 0 6.8p
L53 N074 N073 290n
R57 N075 N074 0.17
C54 N075 0 6.8p
L54 N076 N075 290n
R58 N077 N076 0.17
C55 N077 0 6.8p
L55 N078 N077 290n
R59 N079 N078 0.17
C56 N079 0 6.8p
L56 N080 N079 290n
R60 N081 N080 0.17
C57 N081 0 6.8p
L57 N082 N081 290n
R61 N083 N082 0.17
C58 N083 0 6.8p
L58 N084 N083 290n
R62 N085 N084 0.17
C59 N085 0 6.8p
L59 N086 N085 290n
R63 N087 N086 0.17
C60 N087 0 6.8p
L60 N088 N087 290n
R64 N089 N088 0.17
C61 N089 0 6.8p
L61 N090 N089 290n
R65 N091 N090 0.17
C62 N091 0 6.8p
L62 N092 N091 290n
R66 N093 N092 0.17
C63 N093 0 6.8p
L63 N094 N093 290n
R67 N095 N094 0.17
C64 N095 0 6.8p
L64 N096 N095 290n
R68 N097 N096 0.17
C65 N097 0 6.8p
L65 N098 N097 290n
R69 N099 N098 0.17
C66 N099 0 6.8p
L66 N100 N099 290n
R70 N101 N100 0.17
C67 N101 0 6.8p
L67 N102 N101 290n
R71 N103 N102 0.17
C68 N103 0 6.8p
L68 N104 N103 290n
R72 N105 N104 0.17
C69 N105 0 6.8p
L69 N106 N105 290n
R73 N107 N106 0.17
C70 N107 0 6.8p
L70 N108 N107 290n
R74 N109 N108 0.17
C71 N109 0 6.8p
L71 N110 N109 290n
R75 N111 N110 0.17
C72 N111 0 6.8p
L72 N112 N111 290n
R76 N113 N112 0.17
C73 N113 0 6.8p
L73 N114 N113 290n
R77 N115 N114 0.17
C74 N115 0 6.8p
L74 N116 N115 290n
R78 N117 N116 0.17
C75 N117 0 6.8p
L75 N118 N117 290n
R79 N119 N118 0.17
C76 N119 0 6.8p
L76 N120 N119 290n
R80 N121 N120 0.17
C77 N121 0 6.8p
L77 N122 N121 290n
R81 N123 N122 0.17
C78 N123 0 6.8p
L78 N124 N123 290n
R82 N125 N124 0.17
C79 N125 0 6.8p
L79 N126 N125 290n
R83 N127 N126 0.17
C80 N127 0 6.8p
L80 N128 N127 290n
R84 OUT N128 0.17
C81 OUT 0 6.8p
R85 OUT 0 220
R86 OUT 0 1E6
C82 OUT 0 25p
R1 N001 0 220
C10 N001 0 6.8p
.tran 300n
.backanno
.end